# Altium schematic sheet FPGA_Misc.SchDoc
size A4
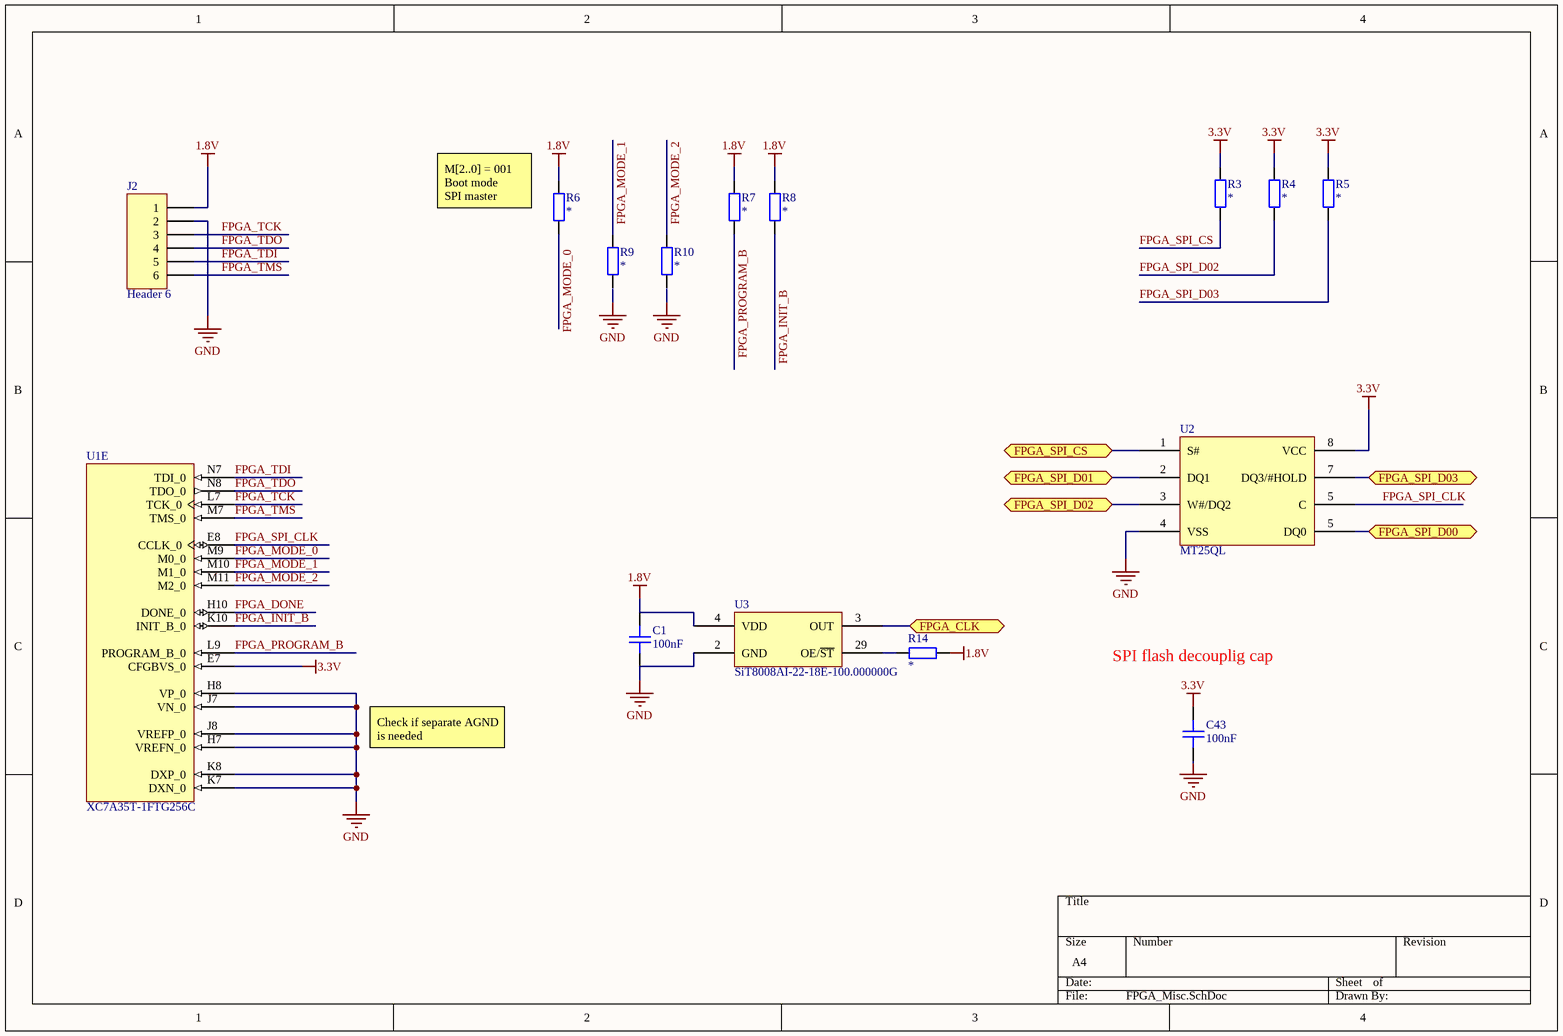
[diagram p0: FPGA_Misc.SchDoc]

## Parts
C1  100nF  [CAP0402]
C43  100nF  [CAP0402]
J2  Header 6  [HDR1X6]
R3  *  [RES0402]
R4  *  [RES0402]
R5  *  [RES0402]
R6  *  [RES0402]
R7  *  [RES0402]
R8  *  [RES0402]
R9  *  [RES0402]
R10  *  [RES0402]
R14  *  [RES0402]
U1  XC7A35T-1FTG256C  [FTG256]  (part E of 8)
U2  MT25QL
U3  SiT8008AI-22-18E-100.000000G

## Ports
FPGA_CLK, FPGA_SPI_CS, FPGA_SPI_D00, FPGA_SPI_D01, FPGA_SPI_D02, FPGA_SPI_D03

## Nets
1.8V: J2.1 U3.4(VDD)
3.3V: U1.E7(CFGBVS_0) U2.8(VCC)
GND: J2.2 U1.H7(VREFN_0) U1.H8(VP_0) U1.J7(VN_0) U1.J8(VREFP_0) U1.K7(DXN_0) U1.K8(DXP_0) U2.4(VSS) U3.2(GND)
FPGA_CLK: U3.3(OUT) ; port FPGA_CLK
FPGA_DONE: U1.H10(DONE_0)
FPGA_INIT_B: U1.K10(INIT_B_0)
FPGA_MODE_0: U1.M9(M0_0)
FPGA_MODE_1: U1.M10(M1_0)
FPGA_MODE_2: U1.M11(M2_0)
FPGA_PROGRAM_B: U1.L9(PROGRAM_B_0)
FPGA_SPI_CLK: U1.E8(CCLK_0) U2.5(C)
FPGA_SPI_CS: U2.1(S#) ; port FPGA_SPI_CS
FPGA_SPI_D00: U2.5(DQ0) ; port FPGA_SPI_D00
FPGA_SPI_D01: U2.2(DQ1) ; port FPGA_SPI_D01
FPGA_SPI_D02: U2.3(W#/DQ2) ; port FPGA_SPI_D02
FPGA_SPI_D03: U2.7(DQ3/#HOLD) ; port FPGA_SPI_D03
FPGA_TCK: J2.3 U1.L7(TCK_0)
FPGA_TDI: J2.5 U1.N7(TDI_0)
FPGA_TDO: J2.4 U1.N8(TDO_0)
FPGA_TMS: J2.6 U1.M7(TMS_0)

Not connected (* = marked no-connect by the designer): C1 1 2; C43 1 2; R3 1 2; R4 1 2; R5 1 2; R6 1 2; R7 1 2; R8 1 2; R9 1 2; R10 1 2; R14 1 2; U3 29(OE/~{ST})

## Notes on the sheet
- (near R6) M[2..0] = 001
  Boot mode
  SPI master
- (near C43) SPI flash decouplig cap
- Check if separate AGND is needed
- Labels drawn without touching a wire or pin: 1.8V, 3.3V

## Library data of the parts
C1 C43 = Cap_0402: Value: 100nF
J2 = Header 6: Header, 6-Pin; LatestRevisionDate: 17-Jul-2002; LatestRevisionNote: Re-released for DXP Platform.; Publisher: Altium Limited
R3-R10 R14 = Res_0402: Value: *
U1 = XC7A35T-1FTG256C: Artix-7 FPGA, 170 User I/Os, 0 GTP, 256-Ball BGA, Speed Grade 1, Commercial Grade, Pb-Free; Manufacturer: Xilinx; Total Block RAM: 1800 Kb; GTP: 0; Clock Mgmt Tiles (CMTs): 5; Logic Cells: 33280; Available User I/O: 170; Speed Grades: 1; DatasheetVersion: v1.15; PackageVersion: Rev. 1.11; PackageReference: FTG-256; PackageDescription: 256-Ball Wire-Bond Fine-Pitch Thin BGA, Body 17 x 17 mm, Pitch 1 mm; Maximum Distributed RAM: 400 Kb; Operating Temperature Range: Commercial; NexusDeviceID: XC7A35T-1FTG256C; Mounting Technology: Surface Mount; PartNumber: XC7A35T-1FTG256C; ComponentLink1Description: Manufacturer URL; ComponentLink1URL: http://www.xilinx.com/; ComponentLink2Description: Datasheet; ComponentLink2URL: http://www.xilinx.com/support/documentation/data_sheets/ds180_7Series_Overview.pdf; ComponentLink3Description: Package Specification; ComponentLink3URL: http://www.xilinx.com/support/documentation/user_guides/ug475_7Series_Pkg_Pinout.pdf; ComponentLink4Description: DC and Switching Characteristics; ComponentLink4URL: http://www.xilinx.com/support/documentation/data_sheets/ds181_Artix_7_Data_Sheet.pdf; ComponentLink5Description: Package File; ComponentLink5URL: http://www.xilinx.com/support/packagefiles/a7packages/xc7a200tsbg484pkg.txt; ComponentLink6Description: Packaging and Pinout; ComponentLink6URL: http://www.xilinx.com/support/documentation/user_guides/ug475_7Series_Pkg_Pinout.pdf